# EAGLE design MTRduino_Rev3.1 (EAGLE 7.2.0)
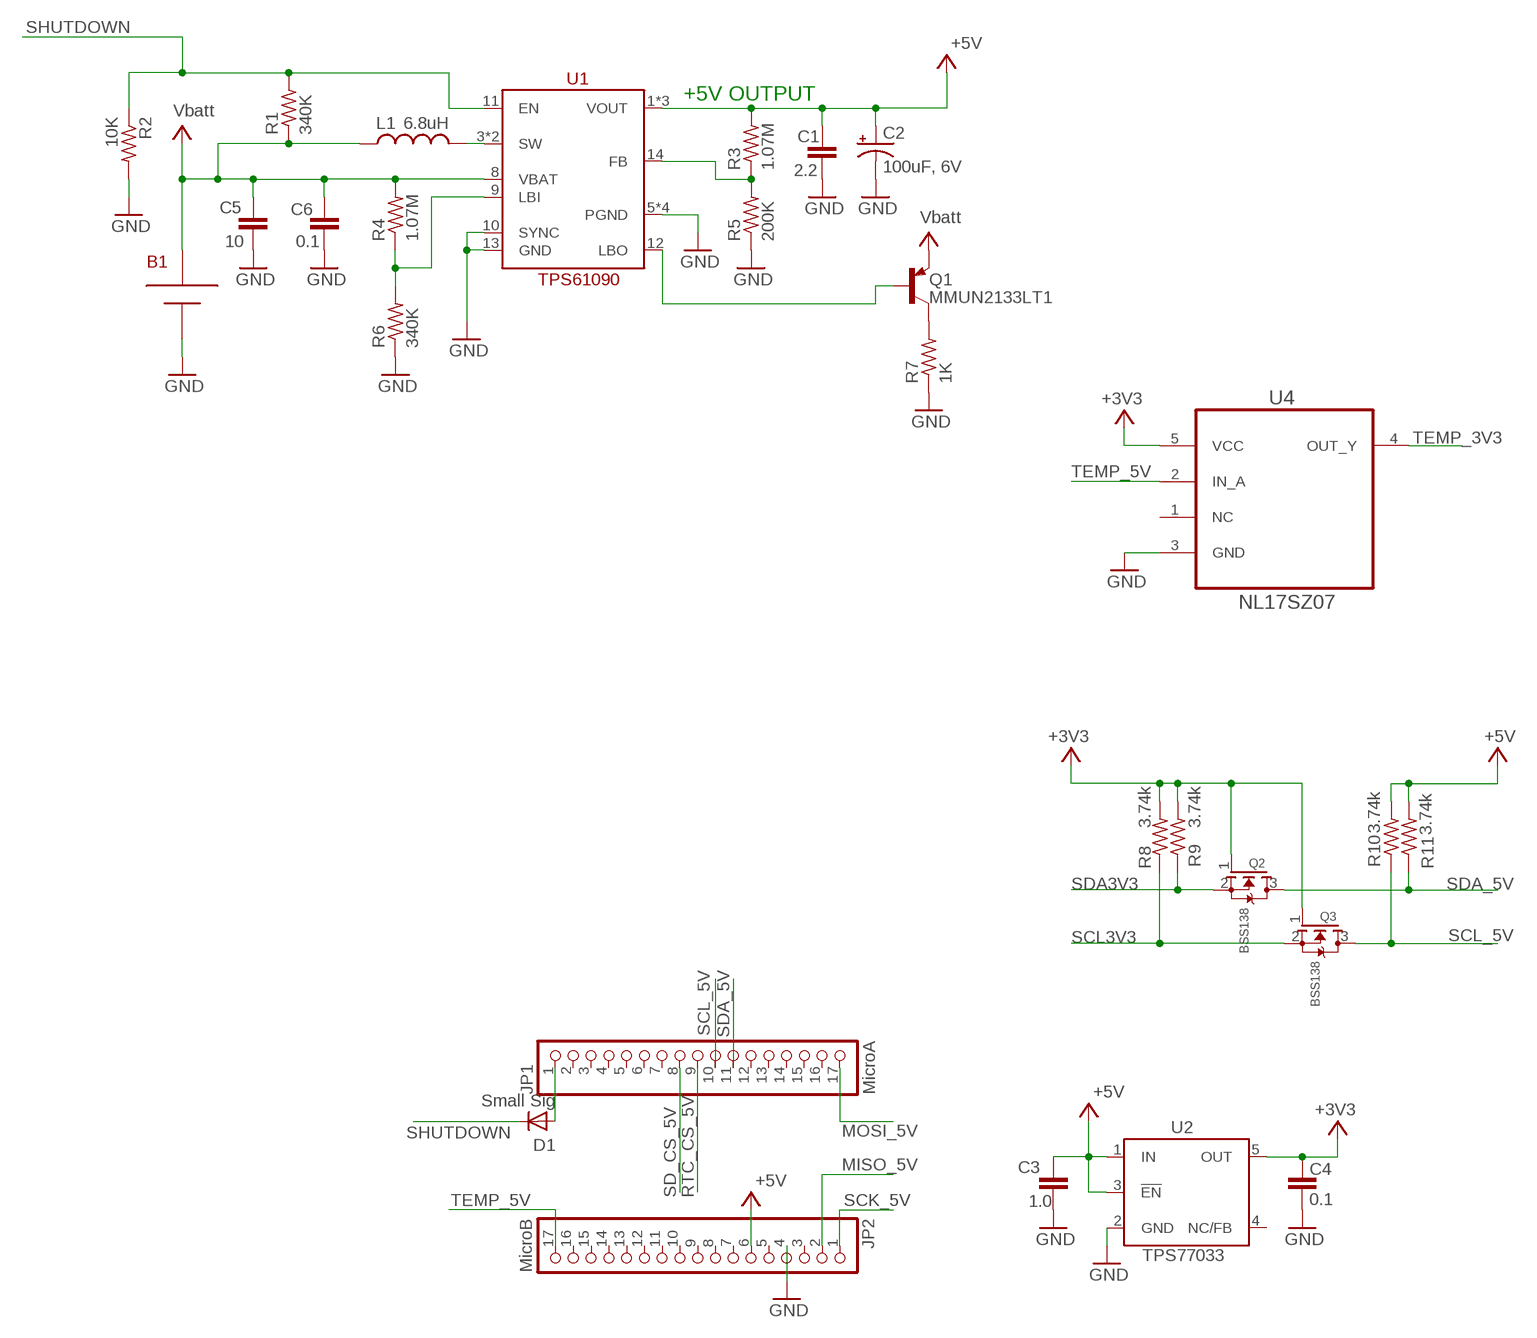
[diagram p0: schematic, sheet 1, part 1 of 2]
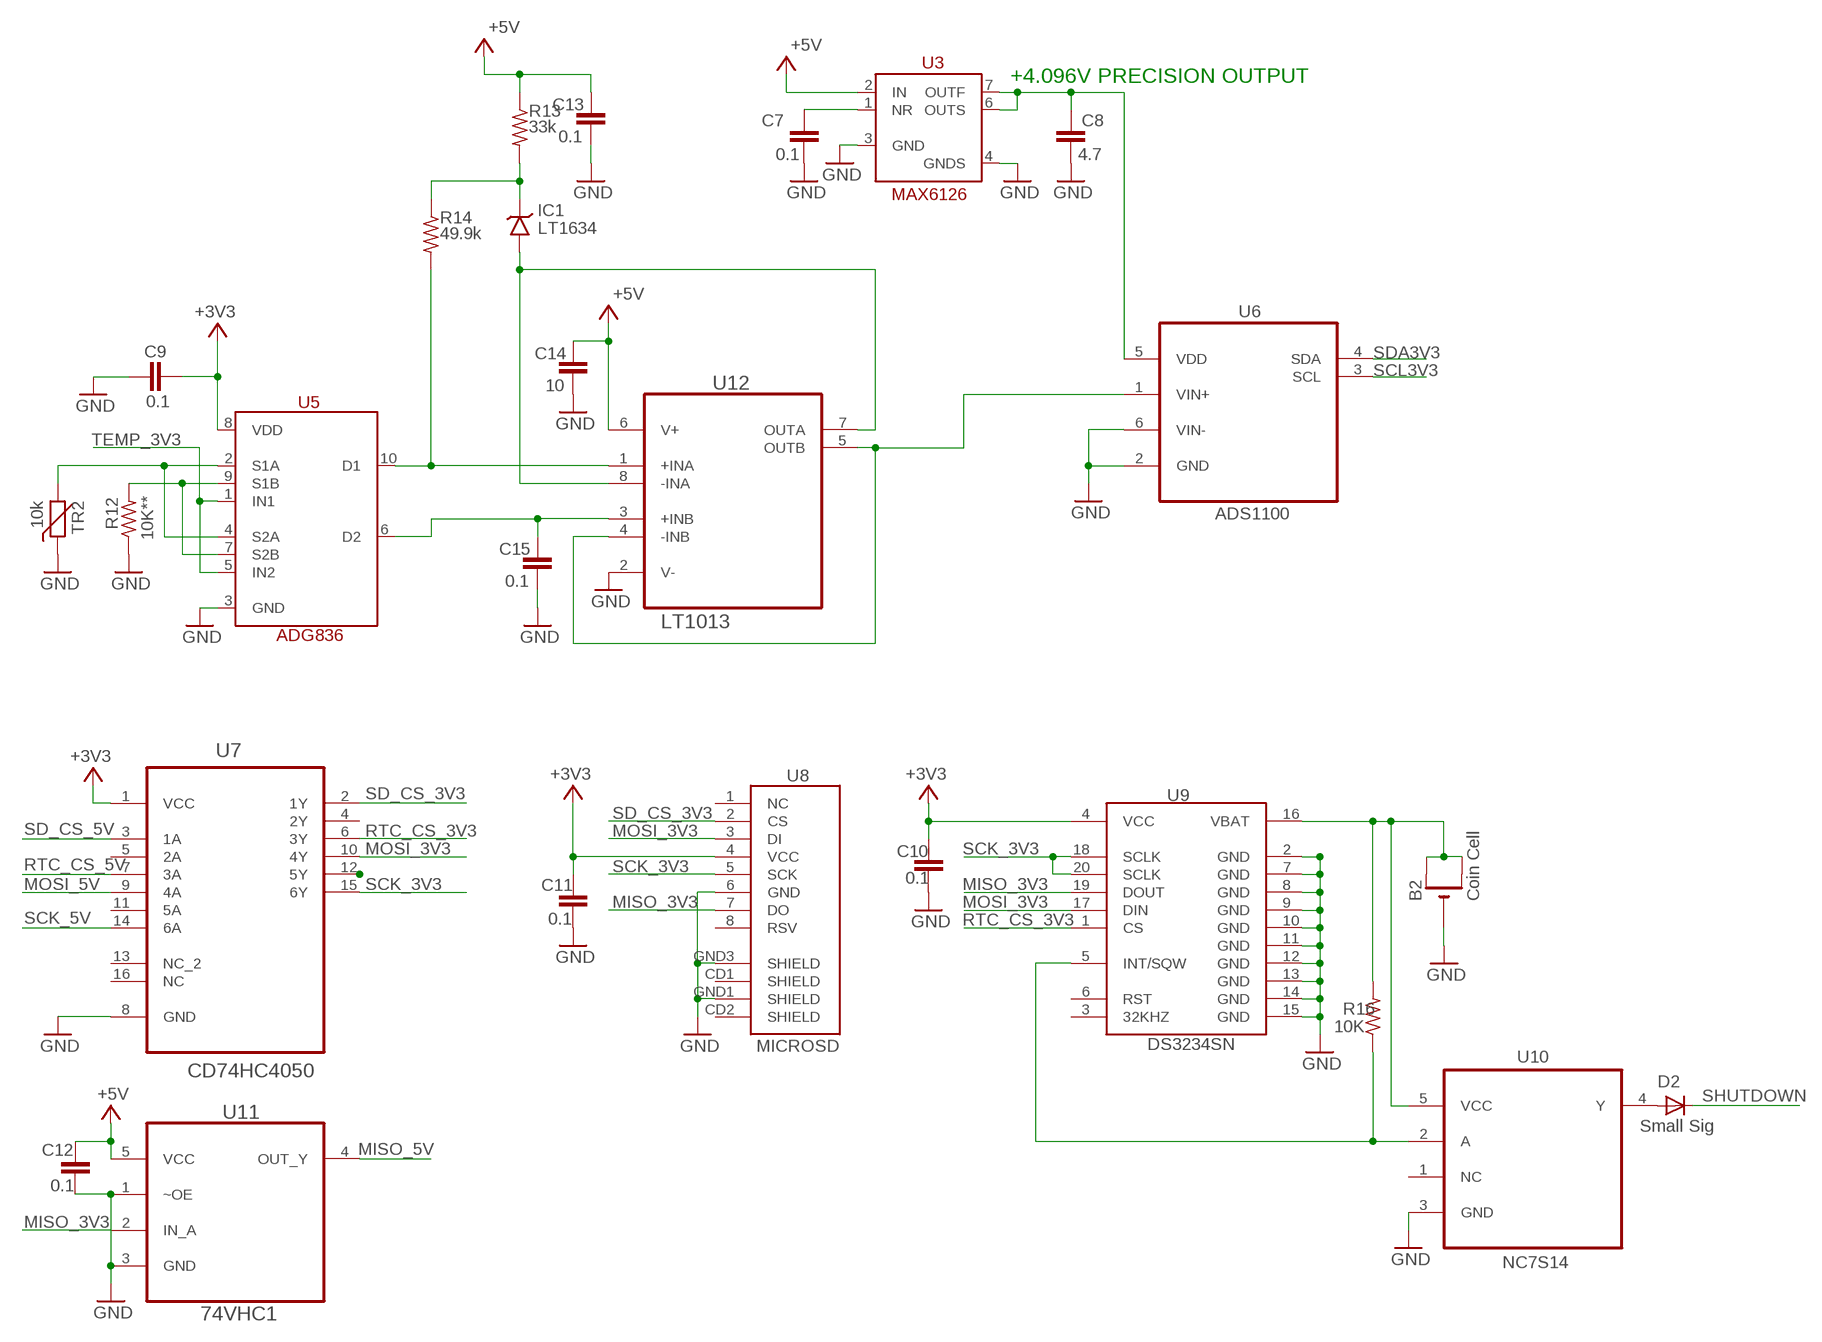
[diagram p1: schematic, sheet 1, part 2 of 2]

## Parts
B1  2x AA BATT  BATT_AA2  [BATT_AA2]
B2  Coin Cell  CR1220SMT  [CR1220-SMD]
C1  2.2  C-EUC0603  [C0603]
C2  100uF, 6V  CPOL-USA/3216-18R  [A/3216-18R]
C3  1.0  C-EUC0603  [C0603]
C4  0.1  C-EUC0603  [C0603]
C5  10  C-EUC0603  [C0603]
C6  0.1  C-EUC0603  [C0603]
C7  0.1  C-EUC0603  [C0603]
C8  4.7  C-EUC0603  [C0603]
C9  0.1  C-EUC0603  [C0603]
C10  0.1  C-EUC0603  [C0603]
C11  0.1  C-EUC0603  [C0603]
C12  0.1  C-EUC0603  [C0603]
C13  0.1  C-EUC0603  [C0603]
C14  10  C-EUC0603  [C0603]
C15  0.1  C-EUC0603  [C0603]
D1  Small Sig  DIODESOD-323F  [SOD-323F]
D2  Small Sig  DIODESOD-323F  [SOD-323F]
IC1  LT1634  LT1634BIS8-1.25  [S8]
JP1  MicroA  PINHD-1X17  [1X17]
JP2  MicroB  PINHD-1X17  [1X17]
L1  6.8uH  L-USL2012C  [L2012C]
Q1  MMUN2133LT1  MMUN2111LT1  [SC59-BEC]
Q2  BSS138  MOSFET-NREFLOW  [SOT23]
Q3  BSS138  MOSFET-NREFLOW  [SOT23]
R1  340K  R-US_R0603  [R0603]
R2  10K  R-US_R0603  [R0603]
R3  1.07M  R-US_R0603  [R0603]
R4  1.07M  R-US_R0603  [R0603]
R5  200K  R-US_R0603  [R0603]
R6  340K  R-US_R0603  [R0603]
R7  1K  R-US_R0603  [R0603]
R8  3.74k  R-US_R0603  [R0603]
R9  3.74k  R-US_R0603  [R0603]
R10  3.74k  R-US_R0603  [R0603]
R11  3.74k  R-US_R0603  [R0603]
R12  10K**  R-US_R1206  [R1206]
R13  33k  R-US_R0603  [R0603]
R14  49.9k  R-US_R0603  [R0603]
R16  10K  R-US_R0603  [R0603]
TR2  10k  THERMISTOR_R-5  [R-5]
U1  TPS61090  TPS61090RSAR  [QFN16-4X4]
U2  TPS77033  TPS77030  [SOT23-DBV]
U3  MAX6126  [SOIC127P600X175-8N]
U4  NL17SZ07  NL17SZ07DFT2G  [SOT65P210X110-5N]
U5  ADG836  [MSOP10]
U6  ADS1100  ADS1100A0IDBVT  [SOT95P280X145-6N]
U7  CD74HC4050  M74HC4050RM13TR  [SOIC127P600X175-16N]
U8  MICROSD  USD-SOCKETNEW  [MICRO-SD-SOCKET-PP]
U9  DS3234SN  DS3234  [DS3234]
U10  NC7S14  1P1G14MDBVREPG4  [SOT95P280X145-5N]
U11  74VHC1  M74VHC1GT125DF1G  [SOT65P210X110-5N]
U12  LT1013  LT1013DS8PBF  [SOIC127P600X175-8N]

## Nets
+3V3: C4.1 C9.2 C10.1 C11.1 Q2.1(G) Q3.1(G) R8.2 R9.2 U2.5(OUT) U4.5(VCC) U5.8(VDD) U7.1(VCC) U8.4(VCC) U9.4(VCC)
+5V: C1.1 C2.+ C3.1 C12.1 C13.2 C14.2 JP2.6 R3.2 R10.2 R11.2 R13.1 U1.1(VOUT) U1.15(VOUT) U1.16(VOUT) U2.1(IN) U2.3(!EN) U3.2(IN) U11.5(VCC) U12.6(V+)
GND: B1.+ B2.- C1.2 C2.- C3.2 C4.2 C5.2 C6.2 C7.2 C8.2 C9.1 C10.2 C11.2 C12.2 C13.1 C14.1 C15.1 JP2.4 R2.2 R5.1 R6.1 R7.1 R12.1 TR2.1 U1.5(PGND) U1.6(PGND) U1.7(PGND) U1.10(SYNC) U1.13(GND) U1.EXP(PGND) U2.2(GND) U3.3(GND) U3.4(GNDS) U4.3(GND) U5.3(GND) U6.2(GND) U6.6(VIN-) U7.8(GND) U8.6(GND) U8.GND1(SHIELD) U8.GND3(SHIELD) U9.2(GND) U9.7(GND) U9.8(GND) U9.9(GND) U9.10(GND) U9.11(GND) U9.12(GND) U9.13(GND) U9.14(GND) U9.15(GND) U10.3(GND) U11.1(~OE) U11.3(GND) U12.2(V-)
MISO_3V3: U8.7(DO) U9.19(DOUT) U11.2(IN_A)
MISO_5V: JP2.2 U11.4(OUT_Y)
MOSI_3V3: U7.10(4Y) U8.3(DI) U9.17(DIN)
MOSI_5V: JP1.17 U7.9(4A)
N$1: D2.A U10.4(Y)
N$2: C15.2 U5.6(D2) U12.3(+INB)
N$3: U7.12(5Y)
N$4: C7.1 U3.1(NR)
N$5: U6.1(VIN+) U12.4(-INB) U12.5(OUTB)
N$6: B2.+$1(+) B2.+$2(+1) R16.2 U9.16(VBAT) U10.5(VCC)
N$7: L1.2 U1.3(SW) U1.4(SW)
N$8: IC1.6(VOUT) R13.2 R14.1
N$9: TR2.2 U5.2(S1A) U5.4(S2A)
N$10: R12.2 U5.7(S2B) U5.9(S1B)
N$11: R4.1 R6.2 U1.9(LBI)
N$12: Q1.C R7.2
N$13: R3.1 R5.2 U1.14(FB)
N$14: IC1.4(GND) U12.7(OUTA) U12.8(-INA)
N$16: R14.2 U5.10(D1) U12.1(+INA)
N$17: R16.1 U9.5(INT/SQW) U10.2(A)
N$19: Q1.B U1.12(LBO)
N$21: D1.A JP1.1
N$38: C8.1 U3.6(OUTS) U3.7(OUTF) U6.5(VDD)
RTC_CS_3V3: U7.6(3Y) U9.1(CS)
RTC_CS_5V: JP1.9 U7.7(3A)
SCK_3V3: U7.15(6Y) U8.5(SCK) U9.18(SCLK) U9.20(SCLK)
SCK_5V: JP2.1 U7.14(6A)
SCL3V3: Q3.2(S) R8.1 U6.3(SCL)
SCL_5V: JP1.10 Q3.3(D) R10.1
SD_CS_3V3: U7.2(1Y) U8.2(CS)
SD_CS_5V: JP1.8 U7.3(1A)
SDA3V3: Q2.2(S) R9.1 U6.4(SDA)
SDA_5V: JP1.11 Q2.3(D) R11.1
SHUTDOWN: D1.C D2.C R1.2 R2.1 U1.11(EN)
TEMP_3V3: U4.4(OUT_Y) U5.1(IN1) U5.5(IN2)
TEMP_5V: JP2.17 U4.2(IN_A)
V+: B1.- C5.1 C6.1 L1.1 Q1.E R1.1 R4.2 U1.8(VBAT) ; supply symbol labelled Vbatt
Unconnected: JP1.2 JP1.3 JP1.4 JP1.5 JP1.6 JP1.7 JP1.12 JP1.13 JP1.14 JP1.15 JP1.16 JP2.3 JP2.5 JP2.7 JP2.8 JP2.9 JP2.10 JP2.11 JP2.12 JP2.13 JP2.14 JP2.15 JP2.16 U2.4(NC/FB) U4.1(NC) U7.4(2Y) U7.5(2A) U7.11(5A) U7.13(NC_2) U7.16(NC) U8.1(NC) U8.8(RSV) U8.CD1(SHIELD) U8.CD2(SHIELD) U9.3(32KHZ) U9.6(RST) U10.1(NC)

## Notes on the sheet
- +4.096V PRECISION OUTPUT
- +5V OUTPUT

## Library data of the parts
B1 = adafruit:BATT_AA2
B2 = adafruit:CR1220: CR1216/CR1220/CR1225 12mm 3V lithium coin cell Great for battery packup. Both SMT and THM holders. Note the THM package has the ground pads on both sides of the PCB so that the masks are the same - this reduces the cost
C1 C3-C15 = rcl:C-EU: CAPACITOR, European symbol
C2 = rcl:CPOL-US: POLARIZED CAPACITOR, American symbol
D1 D2 = adafruit:DIODE: Diode SMADIODE - SMA Surface Mount Package 20V 1A Schottky Diode Digikey: 641-1014-6-ND DO-1N4148 - Through Hole Small Current Diode SOD-123 20V 1 A (.5mV Vf) Schottky Diode - Digikey: MBRX120TPMSCT-ND SOD-323 10V 570mA (.38mV Vf, 3ns) Schottky Diode - Digikey: ZLLS410CT-ND SOD-523 30V 30mA Schottky Diode (RB751S-40TE61) - Digikey: RB751S-40TE61CT-ND SOT23-R/W - SOT23 Package (R = Solder Paste/Reflow Ovens, W = Hand-Soldering) BAT54Film 40V 300mA - Digikey: 497-7162-1-ND
IC1 = linear-technology:LT1634: Micropower Precision Shunt Voltage Reference Source: Darta sheet <http://cds.linear.com/docs/en/datasheet/1634fe.pdf>
JP1 JP2 = pinhead:PINHD-1X17: PIN HEADER
L1 = rcl:L-US: INDUCTOR, American symbol
Q1 = transistor-pnp:MMUN2111*: PNP Transistror
Q2 Q3 = adafruit:MOSFET-N: N-Channel Mosfet 2N7002E - 60V 260mA SOT23 [Digikey: 2N7002ET1GOSTR-ND] - REEL BSH103 - 30V 850mA SOT23 [Digikey: 568-5013-1-ND]
R1-R11 R13 R14 R16 = resistor:R-US_: RESISTOR, American symbol
R12 = rcl:R-US_: RESISTOR, American symbol
TR2 = discrete:THERMISTOR_: Thermo Resistor
U1 = microchip:TPS61090RSAR
U2 = texas:TPS770*: ULTRALOW-POWER 50-mA LOW-DROPOUT LINEAR REGULATORS 50-mA Low-Dropout Regulator Source: http://focus.ti.com/lit/ds/symlink/tps77001.pdf; MF: TEXAS INSTRUMENTS; MPN: TPS77030DBVT; OC_FARNELL: 1207348; OC_NEWARK: 77C1185
U3 = Maxim_By_element14_Batch_1:MAX6126
U4 = ON Semiconductor_By_element14_Batch_1:NL17SZ07DFT2G: Single Non-Inverting Buffer with Open Drain Output; MPN: NL17SZ07DFT2G; OC_FARNELL: 1705431; OC_NEWARK: 04R7799; PACKAGE: SOT-353-5; SUPPLIER: ON Semiconductor
U5 = analog-devices:ADG836
U6 = Texas Instruments_By_element14_Batch_1:ADS1100A0IDBVT: Self-Calibrating, 16-Bit ANALOG-TO-DIGITAL CONVERTER; MPN: ADS1100A0IDBVT; OC_FARNELL: 1135959; OC_NEWARK: 20H0708; PACKAGE: SOT-23-6; SUPPLIER: Texas Instruments
U7 = ST Microelctronics_By_element14_Batch_1:M74HC4050RM13TR: HEX BUFFER/CONVERTER; MPN: M74HC4050RM13TR; OC_FARNELL: 1261257; OC_NEWARK: 89K0905; PACKAGE: SOIC-16; SUPPLIER: STMICROELECTRONICS
U8 = SparkFun-Connectors:USD-SOCKET: microSD Socket Push-push type uSD socket. Schematic element and footprint production proven. Spark Fun Electronics SKU : PRT-00127. tDoc lines correctly indicate media card edge positions when inserting (unlocked, locked, depressed).
U9 = SparkFun-FreqCtrl:DS3234: SPI RTC module with battery backup and internal clock.
U10 = Texas Instruments_By_element14_Batch_1:1P1G14MDBVREPG4: SINGLE SCHMITT-TRIGGER INVERTER; MPN: 1P1G14MDBVREPG4; OC_FARNELL: -; OC_NEWARK: 56P2415; PACKAGE: SOT-23-5; SUPPLIER: Texas Instruments
U11 = ON Semiconductor_By_element14_Batch_1:M74VHC1GT125DF1G: Noninverting Buffer / CMOS Logic Level Shifter; MPN: M74VHC1GT125DF1G; OC_FARNELL: 1567363; OC_NEWARK: 83H7591; PACKAGE: SOT-23-5; SUPPLIER: ON SEMICONDUCTOR
U12 = LTC_By_element14_Batch_1:LT1013DS8PBF: Dual Precision Op Amp; MPN: LT1013DS8#PBF; OC_FARNELL: 9559302; OC_NEWARK: 57M0827; PACKAGE: SOIC-8; SUPPLIER: LINEAR TECHNOLOGY

## Board
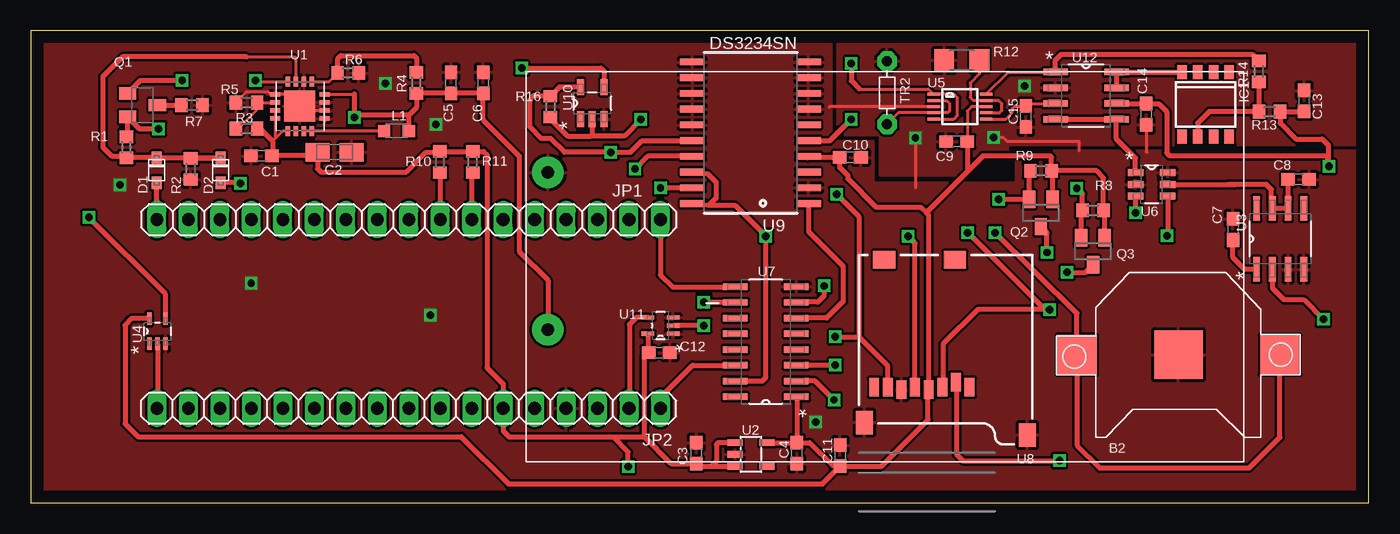
[diagram p2: board, top side]
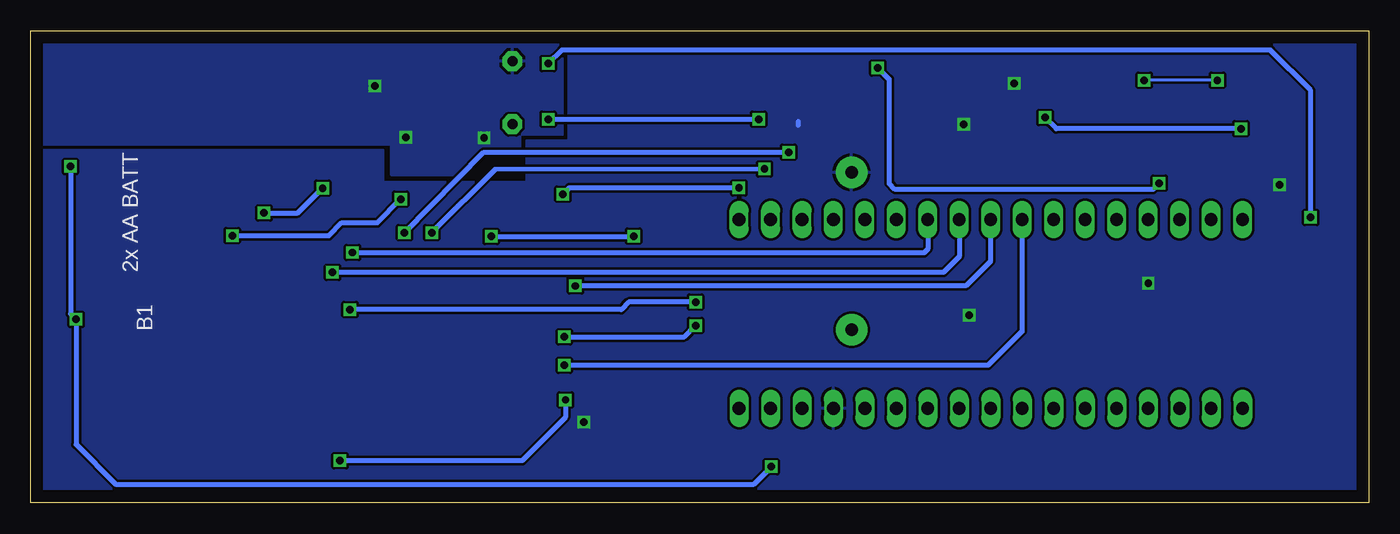
[diagram p3: board, bottom side, seen from below]

Size 107.94 x 38.09 mm. Coordinates in mm from the lower left corner, seen from the top.
Outline: 0,0 107.94,0 107.94,38.09 0,38.09 0,0
Copper layers (1*16): Top 0.035mm / dielectric 1.5mm / Bottom 0.035mm
Design rules "default *": minimum track width 10mil, minimum drill 20mil, track to track 8mil, track to pad 8mil, pad to pad 8mil, via to via 8mil, smd to smd 8mil, copper to edge 40mil, drill to drill 8mil, minimum pad ring 10mil, minimum via ring 8mil, stop-mask expansion 4mil, vias tented up to drill 0mil, thermal gap 10mil

### Footprints (pad centres in the part's own frame; a part is rotated, then mirrored left to right if it is on the bottom)
BATT_AA2 = drill 1 pad 2.54: + -27.178,7.62; - -27.178,-5.08
CR1220-SMD = smd 3.2 x 3.2: +$1 -8.2,0; +$2 8.2,0 | smd 3.9 x 3.9: - 0,0
C0603 = smd 1.1 x 1: 1 -0.85,0; 2 0.85,0
A/3216-18R = smd 1.95 x 1.5: + 1.375,0; - -1.375,0
SOD-323F = smd 1 x 0.8: A -1,0; C 1,0
S8 = smd 0.762 x 1.143: 1 -1.905,-2.6; 2 -0.635,-2.6; 3 0.635,-2.6; 4 1.905,-2.6; 5 1.905,2.6; 6 0.635,2.6; 7 -0.635,2.6; 8 -1.905,2.6
1X17 = drill 1.016 long: 1 -20.32,0; 2 -17.78,0; 3 -15.24,0; 4 -12.7,0; 5 -10.16,0; 6 -7.62,0; 7 -5.08,0; 8 -2.54,0; 9 0,0; 10 2.54,0; 11 5.08,0; 12 7.62,0; 13 10.16,0; 14 12.7,0; 15 15.24,0; 16 17.78,0; 17 20.32,0
L2012C = smd 1 x 1: 1 -1,0; 2 1,0
SC59-BEC = smd 1 x 1.4: B -0.95,-1.2; C 0,1.2; E 0.95,-1.2
SOT23 = smd 1 x 1.4: 1 -0.95,-1.1; 2 0.95,-1.1; 3 0,1.1
R0603 = smd 1 x 1.1: 1 -0.85,0; 2 0.85,0
R1206 = smd 1.6 x 1.803: 1 -1.422,0; 2 1.422,0
R-5 = drill 0.813 pad 1.6 octagon: 1 -2.54,0; 2 2.54,0
QFN16-4X4 = smd 0.8 x 0.35: 1 -2,0.975; 2 -2,0.325; 3 -2,-0.325; 4 -2,-0.975; 9 2,-0.975; 10 2,-0.325; 11 2,0.325; 12 2,0.975 | smd 0.35 x 0.8: 5 -0.975,-2; 6 -0.325,-2; 7 0.325,-2; 8 0.975,-2; 13 0.975,2; 14 0.325,2; 15 -0.325,2; 16 -0.975,2 | smd 2.5 x 2.5: EXP 0,0
SOT23-DBV = smd 0.55 x 1.2: 1 -0.95,-1.3; 2 0,-1.3; 3 0.95,-1.3; 4 0.95,1.3; 5 -0.95,1.3
SOIC127P600X175-8N = smd 1.981 x 0.533: 1 -2.464,1.905; 2 -2.464,0.635; 3 -2.464,-0.635; 4 -2.464,-1.905; 5 2.464,-1.905; 6 2.464,-0.635; 7 2.464,0.635; 8 2.464,1.905
SOT65P210X110-5N = smd 1.016 x 0.356: 1 -1.016,0.66; 2 -1.016,0; 3 -1.016,-0.66; 4 1.016,-0.66; 5 1.016,0.66
MSOP10 = smd 0.25 x 1: 1 -1,-2.113; 2 -0.5,-2.113; 3 0,-2.113; 4 0.5,-2.113; 5 1,-2.113; 6 1,2.113; 7 0.5,2.113; 8 0,2.113; 9 -0.5,2.113; 10 -1,2.113
SOT95P280X145-6N = smd 1.27 x 0.559: 1 -1.295,0.94; 2 -1.295,0; 3 -1.295,-0.94; 4 1.295,-0.94; 5 1.295,0; 6 1.295,0.94
SOIC127P600X175-16N = smd 1.981 x 0.508: 1 -2.464,4.445; 2 -2.464,3.175; 3 -2.464,1.905; 4 -2.464,0.635; 5 -2.464,-0.635; 6 -2.464,-1.905; 7 -2.464,-3.175; 8 -2.464,-4.445; 9 2.464,-4.445; 10 2.464,-3.175; 11 2.464,-1.905; 12 2.464,-0.635; 13 2.464,0.635; 14 2.464,1.905; 15 2.464,3.175; 16 2.464,4.445
MICRO-SD-SOCKET-PP = smd 0.8 x 1.5: 1 -8.94,10.7; 2 -7.84,10.3; 3 -6.74,10.7; 4 -5.64,10.9; 5 -4.54,10.7; 6 -3.44,10.9; 7 -2.34,10.7; 8 -1.24,10.7 | smd 1.8 x 1.4: CD1 -2.05,0.4; CD2 -7.75,0.4 | smd 1.4 x 1.9: GND1 -13.6,14.55; GND3 -0.45,13.55
DS3234 = smd 0.53 x 1.98: 1 -5.715,-4.685; 2 -4.445,-4.685; 3 -3.175,-4.685; 4 -1.905,-4.685; 5 -0.635,-4.685; 6 0.635,-4.685; 7 1.905,-4.685; 8 3.175,-4.685; 9 4.445,-4.685; 10 5.715,-4.685; 11 5.715,4.685; 12 4.445,4.685; 13 3.175,4.685; 14 1.905,4.685; 15 0.635,4.685; 16 -0.635,4.685; 17 -1.905,4.685; 18 -3.175,4.685; 19 -4.445,4.685; 20 -5.715,4.685
SOT95P280X145-5N = smd 1.27 x 0.559: 1 -1.295,0.94; 2 -1.295,0; 3 -1.295,-0.94; 4 1.295,-0.94; 5 1.295,0.94

### Placement (x,y rotation side)
B1  68.9,19.05 0 top
B2  92.6,11.94 180 top
C1  18.6,28 180 top
C2  24.5,28.3 180 top
C3  53.7,4 90 top
C4  61.8,4 270 top
C5  33.9,33.9 90 top
C6  36.5,33.9 90 top
C7  97,22.06 90 top
C8  102.3,26.1 0 top
C9  74.7,29.16 0 top
C10  66.13,27.87 0 top
C11  65.3,3.8 90 top
C12  50.7,12.1 0 top
C13  102.74,32.44 270 top
C14  89.99,31.37 90 top
C15  80.29,31.19 90 top
D1  10.14,26.84 90 top
D2  15.3,26.84 90 top
IC1  94.79,32.16 180 top
JP1  30.48,22.86 0 top
JP2  30.48,7.62 180 top
L1  29.5,30 180 top
Q1  9,32.1 270 top
Q2  81.5,23.4 180 top
Q3  85.7,20.3 180 top
R1  7.7,28.7 270 top
R2  12.89,26.94 270 top
R3  17.4,30.2 0 top
R4  31.1,33.9 270 top
R5  17.4,32.3 0 top
R6  25.6,34.7 180 top
R7  13,32.1 180 top
R8  85.7,23.6 0 top
R9  81.5,26.8 0 top
R10  32.99,27.51 90 top
R11  35.65,27.51 90 top
R12  75.12,35.72 0 top
R13  99.95,31.57 180 top
R14  99.09,34.82 90 top
R16  41.92,31.98 90 top
TR2  69.09,33.1 270 top
U1  21.7,32 90 top
U2  58.1,3.9 270 top
U3  100.81,21.3 90 top
U4  10.21,13.84 90 top
U5  74.96,31.98 270 top
U6  90.43,25.7 0 top
U7  59.3,13 180 top
U8  66.8,20.02 180 top
U9  58.06,29.87 90 top
U10  45.29,32.26 90 top
U11  50.8,14.3 180 top
U12  85.14,32.87 0 top

### Tracks (layer width: path | path; a pad name or v marks a point on that pad's centre or on a via)
+3V3
  Top 0.254: R9.2 82.35,24.65 82.5,24.5 | U5.8 75.92,31.98 75.56,31.62 75.56,29.17 C9.2
  Top 0.406: U7.1 61.8,8.52 C4.1 | 65.1,3 64.7,3 62.85,4.85 C4.1 | 65.1,3 65.25,3 | 62.68,27.87 U9.4 | U2.5 C4.1 | C11.1 65.15,2.95 65.1,3 | C11.1 68.65,2.95 72.4,6.7 72.4,9.07 U8.4 72.44,23.22 72.24,23.42 | 62.67,27.86 U9.4 | Q3.1 86.65,23.5 R8.2 86.55,26.25 86,26.8 R9.2 | Q2.1 82.45,26.7 R9.2 | U4.5 8.1,14.86 7.59,14.35 7.59,6.38 8.64,5.33 34.72,5.33 38.53,1.52 63.87,1.52 C11.1 | U9.4 62.68,27.87 C10.1 65.28,27.05 65.91,26.42 65.91,26.16 68.22,23.85 71.81,23.85 72.24,23.42 | R9.2 82.35,27.89 82.25,27.99 76.81,27.99 75.56,26.75 | 72.24,23.42 75.12,26.3 75.56,26.75 | 75.56,29.17 75.56,26.75
+5V  (via drill 0.6)
  Top 0.254: U1.1 20.3,30 19.7,29.4 | U1.15 U1.16 19.7,29.4 | 19.7,29.4 19.5,29.2
  Top 0.406: 23.12,28 C2.+ | C2.+ 23.12,26.98 23.4,26.7 30.3,26.7 31.9,28.3 32.94,28.3 R10.2 R11.2 36.54,28.36 36.8,28.1 36.8,10.9 38.1,9.6 JP2.6 38.1,5.8 38.6,5.3 47,5.3 | R3.2 18.5,30.2 19.5,29.2 19.5,28.05 | 54.9,2.95 53.9,2.95 C3.1 51.65,3.15 49.5,5.3 | 54.9,2.95 U2.3 | 49.5,5.3 49.5,11.85 49.6,11.85 C12.1 49.85,13.57 U11.5 | 47,5.3 49.5,5.3 | U2.1 55.45,4.85 55.3,4.7 55.3,3.35 54.9,2.95 | 19.5,28.05 22.88,28.05 C2.+ | C1.1 19.5,28.05 | U3.2 100.17,17.32 101.1,16.4 102.7,16.4 v104.3,14.8 | v48.2,2.9 48.2,4.1 47,5.3 | C13.2 102.73,31.57 R13.1 100.8,30.65 102.08,29.36 104.19,29.36 104.7,28.85 104.7,27.76 | 104.7,27.76 104.7,27.2 v104.75,27.15 | U12.6 89.98,32.23 C14.2 91,32.22 91.64,31.57 91.64,28.25 91.87,28.02 104.44,28.02 104.7,27.76
  Bottom 0.406: v48.2,2.9 49.6,1.5 101.1,1.5 104.3,4.7 v104.3,14.8 104.75,15.25 v104.75,27.15
GND  (via drill 0.6)
  Top 0.254: U1.6 22.02,31.68 U1.EXP 20.73,32.98 U1.13 19.32,32.98 19.1,33.2 17.4,33.2 16.5,32.3 16.4,32.4 16.45,32.4 R5.1 | C14.1 89.99,28.35 90.07,28.27 | U5.3 64.47,31.98 64.41,31.93 | v71.37,29.45 71.37,25.45 71.4,25.43 | v77.67,29.5 78.45,29.5 78.77,29.18 84.58,29.18 84.58,28.4
  Top 0.406: U1.5 23.7,30.9
  Bottom 0.406: 46.04,30.8 46.04,30.48
  other vias: 17.77,17.72 32.23,15.14 7.18,25.66 28.58,33.86 63.32,6.52 32.68,30.56 80.19,33.64
  pour Top: -1.96,39.55 64.54,39.55 64.54,29.21 67.94,29.21 67.94,25.83 79.5,25.83 79.5,28.45 108.43,28.45 108.43,-0.36 -1.93,-0.36 -1.93,39.42
  pour Top: 65.07,38.53 65.07,29.72 68.53,29.72 68.53,26.44 78.82,26.44 78.82,28.93 108.74,28.93 108.76,38.73 65.13,38.76
  pour Bottom: 65.07,38.53 65.07,29.72 68.53,29.72 68.53,26.44 78.82,26.44 78.82,28.93 108.74,28.93 108.76,38.73 65.13,38.76
  pour Bottom: -1.96,39.55 64.54,39.55 64.54,29.21 67.94,29.21 67.94,25.83 79.5,25.83 79.5,28.45 108.43,28.45 108.43,-0.36 -1.93,-0.36 -1.93,39.42
MISO_3V3  (via drill 0.6)
  Top 0.406: v64.9,13.4 66.8,13.4 | 66.8,13.4 69.1,11.1 69.1,9.36 U8.7 | 66.8,13.4 66.8,23.12 v65,24.91 | v54.3,14.3 U11.2 | U9.19 53.37,25.41 v50.8,25.41
  Bottom 0.406: v50.8,25.41 64.5,25.41 v65,24.91 | v64.9,13.4 55.2,13.4 v54.3,14.3
MISO_5V
  Top 0.406: U11.4 48.86,14.96 48.3,14.4 48.3,7.66 JP2.2
MOSI_3V3  (via drill 0.6)
  Top 0.406: U8.3 73.6,9.37 73.6,12.8 76.4,15.6 v82.2,15.6 81.8,15.6 v75.6,21.8 | U7.10 54.33,16.18 v54.3,16.2 | U9.17 49.76,27.96 v48.74,26.95
  Bottom 0.406: v54.3,16.2 59.7,16.2 60.3,15.6 v82.2,15.6 | v48.74,26.95 70.5,26.9 v75.6,21.8
MOSI_5V
  Top 0.406: JP1.17 50.8,18.4 51.8,17.4 56.79,17.4 U7.9
N$1  (via drill 0.6)
  Top 0.406: U10.4 46.25,33.58 46.25,34.85 46,35.1 v39.6,35.1 | D2.A 15.34,25.9 16.8,25.9 v16.9,25.8
  Bottom 0.406: v16.9,25.8 17.4,25.3 38.2,25.3 38.7,25.8 38.7,34.2 v39.6,35.1
N$2
  Top 0.254: U5.6 78.68,30.98 79.2,31.5 79.2,31.83 79.4,32.03 80.28,32.03 C15.2 80.48,32.23 U12.3
N$4
  Top 0.406: U3.1 97.96,18.84 97,19.8 97,20.65 C7.1
N$5
  Top 0.406: U12.4 U12.5 87.61,29.36 89.14,27.83 U6.1
N$6  (via drill 0.6)
  Top 0.406: U10.5 42.65,33.55 R16.2 41.88,32.87 40.56,32.87 40.26,32.56 40.26,30.35 41.2,29.41 41.94,29.41 43.05,28.3 v46.8,28.3 48.39,28.3 49.33,29.23 U9.16 | B2.+$1 100.78,11.92 100.78,5.26 98.32,2.8 86.25,2.8 84.4,4.65 B2.+$2 84.4,15.3 v77.8,21.8
  Bottom 0.406: v77.8,21.8 71.4,28.3 v46.8,28.3
N$7
  Top 0.254: U1.3 U1.4 L1.2
N$8
  Top 0.406: R14.1 99.08,31.59 | 99.08,31.59 R13.2 | 99.08,31.59 95.09,31.59 94.16,30.66 IC1.6
N$9
  Top 0.254: U5.2 72.86,32.46 73.91,32.46 74.12,32.26 74.12,31.62 73.97,31.48 U5.4 70.01,31.48 TR2.2
N$10
  Top 0.254: U5.7 78.16,31.48 78.36,31.67 78.36,32.21 78.11,32.46 77.09,32.46 U5.9 76.02,32.49 75.79,32.72 75.79,33.88 76.54,34.63 R12.2
N$11
  Top 0.254: U1.9 24.05,34 R6.2
  Top 0.406: R6.2 24.75,35.85 25,36.1 30.9,36.1 31.1,35.9 R4.1
N$12
  Top 0.406: Q1.C R7.2
N$13
  Top 0.254: R3.1 16.7,30.2 18.2,31.7 18.2,32.25 R5.2 19.68,32.3 U1.14
N$14
  Top 0.406: U12.7 U12.8 92.87,34.77 IC1.4
N$16
  Top 0.254: U5.10 78.86,34.77 U12.1
  Top 0.406: U12.1 82.68,35.74 83.13,36.2 98.56,36.2 R14.2
N$17  (via drill 0.6)
  Top 0.406: 45.21,29.62 43.28,29.62 41.92,30.98 R16.1 | U10.2 45.29,29.69 45.21,29.62 | v49.23,30.96 47.88,29.62 45.21,29.62 | U9.5 64.47,29.23 v66.19,30.96
  Bottom 0.406: v49.23,30.96 59.97,30.96 63.91,30.96 v66.19,30.96
N$19  (via drill 0.6)
  Top 0.254: v18.1,34.1 18.2,34 U1.12
  Top 0.406: Q1.B 8.85,34.1 v12.2,34.1
  Bottom 0.254: v12.2,34.1 v18.1,34.1
N$21
  Top 0.406: JP1.1 10.16,24.43 10.14,24.43 D1.A
N$38
  Top 0.254: U3.7 U3.6
  Top 0.406: 101.5,24 101.5,23.8 100.21,23.8 U3.7 100.1,23.84 100.1,25.3 99.7,25.7 97.18,25.7 | U3.6 C8.1 | 97.18,25.7 96.59,25.7 | U6.5 97.18,25.7
RTC_CS_3V3
  Top 0.406: U7.6 64.2,14.9 65.54,16.24 65.53,16.25 65.53,19.1 62.75,21.88 U9.1
RTC_CS_5V  (via drill 0.6)
  Top 0.406: v64,17.5 64,16.7 63.5,16.2 61.79,16.2 U7.7
  Bottom 0.406: v64,17.5 32.5,17.5 30.48,19.52 JP1.9
SCK_3V3  (via drill 0.6)
  Top 0.406: 54.71,24.03 54.94,24.26 54.97,24.26 55.3,24.59 55.3,25.88 54.61,26.57 U9.18 | U7.15 59.02,9.82 59.3,10.1 v59.3,21.52 56.79,24.03 54.71,24.03 | v70.8,21.5 71.34,20.96 U8.5 | U9.20 54.71,24.03
  Bottom 0.406: v70.8,21.5 59.32,21.5 v59.3,21.52
SCK_5V
  Top 0.406: U7.14 53.4,11.1 50.8,8.5 JP2.1
SCL3V3  (via drill 0.6)
  Top 0.406: Q3.2 84.75,23.5 R8.1 84.85,24.95 v84.4,25.4 | U6.3 v89.14,23.4 v89.13,23.39
  Bottom 0.406: v89.13,23.39 86.41,23.39 v84.4,25.4
SCL_5V  (via drill 0.6)
  Top 0.406: 32.99,22.89 JP1.10 | R10.1 33.02,26.63 JP1.10 | JP1.10 33.02,22.3 | v83.6,18.6 85.1,18.6 Q3.3
  Bottom 0.406: JP1.10 33.02,19.86 34.29,18.59 v83.59,18.59 v83.6,18.6
SD_CS_3V3  (via drill 0.6)
  Top 0.406: U8.2 74.7,9.66 74.7,3.9 75.2,3.4 v83,3.4 | v64.8,8.3 63.27,9.82 U7.2
  Bottom 0.406: v64.8,8.3 64.8,6.9 68.3,3.4 v83,3.4
SD_CS_5V  (via drill 0.6)
  Top 0.406: v64.9,11.1 v64.89,11.1 U7.3
  Bottom 0.406: v64.9,11.1 30.7,11.1 27.94,13.86 JP1.8
SDA3V3  (via drill 0.6)
  Top 0.406: R9.1 80.55,26.7 Q2.2 v78.1,24.5 | U6.4 91.73,21.6 v91.69,21.57
  Bottom 0.406: v78.1,24.5 80,22.6 80.01,22.61 82.86,22.61 83.9,21.57 v91.69,21.57
SDA_5V  (via drill 0.6)
  Top 0.406: 35.6,22.9 JP1.11 35.56,26.57 R11.1 | v82,20.2 82,21.8 Q2.3
  Bottom 0.406: JP1.11 35.56,20.47 35.87,20.17 81.97,20.17 v82,20.2
SHUTDOWN
  Top 0.254: 17.4,36 21.3,36 21.38,35.92 U1.11
  Top 0.406: D1.C 12.84,27.84 R2.1 15.3,27.79 D2.C D1.C R1.2 7.55,28 6.5,28 5.8,28.7 5.8,34.4 7.4,36 17.4,36
TEMP_3V3  (via drill 0.6)
  Top 0.254: U5.5 74.46,30.98 74.78,31.29 74.78,32.66 74.47,32.97 72.85,32.97 U5.1 72.42,33.4 66.85,33.4
  Top 0.406: U4.4 10.87,16.84 v4.67,23.04 | v66.19,35.46 66.19,34.06 66.85,33.4
  Bottom 0.406: v4.67,23.04 4.67,33.3 7.92,36.55 65.1,36.55 v66.19,35.46
TEMP_5V
  Top 0.406: U4.2 10.21,7.67 JP2.17
V+  (via drill 0.6)
  Top 0.254: U1.8 26.07,32.98 26.1,33
  Top 0.406: R1.1 7.8,29.65 Q1.E 8.75,30.2 v10.3,30.2 | 26.1,33 v26.1,31.1 26.3,31.3 30.5,31.3 | 30.5,31.3 31.1,31.9 R4.2 C5.1 C6.1 36.5,30.9 39.4,28 39.4,20.3 41.72,17.98 B1.- | L1.1 30.5,31.3 | B1.- | 41.7,13.95 B1.-
  Bottom 0.406: v10.3,30.2 25.2,30.2 v26.1,31.1

### Text on the board
tValues: 12 | 11 | 10 | 9 | 8 | 7 | 6 | 5 | 4 | 3 | 2 | RS | RX | TX | SS | GND | MOSI | 13 | 3V | AREF | A0 | A1 | A2 | A3 | A4 | A5 | NC | NC | +5V | RS | VIN | MISO | GND | SCK | MTRDuino (Version 3.1) | NOAA/PMEL/Eco-FOCI